# EAGLE schematic Untitled (EAGLE 7.1.0)
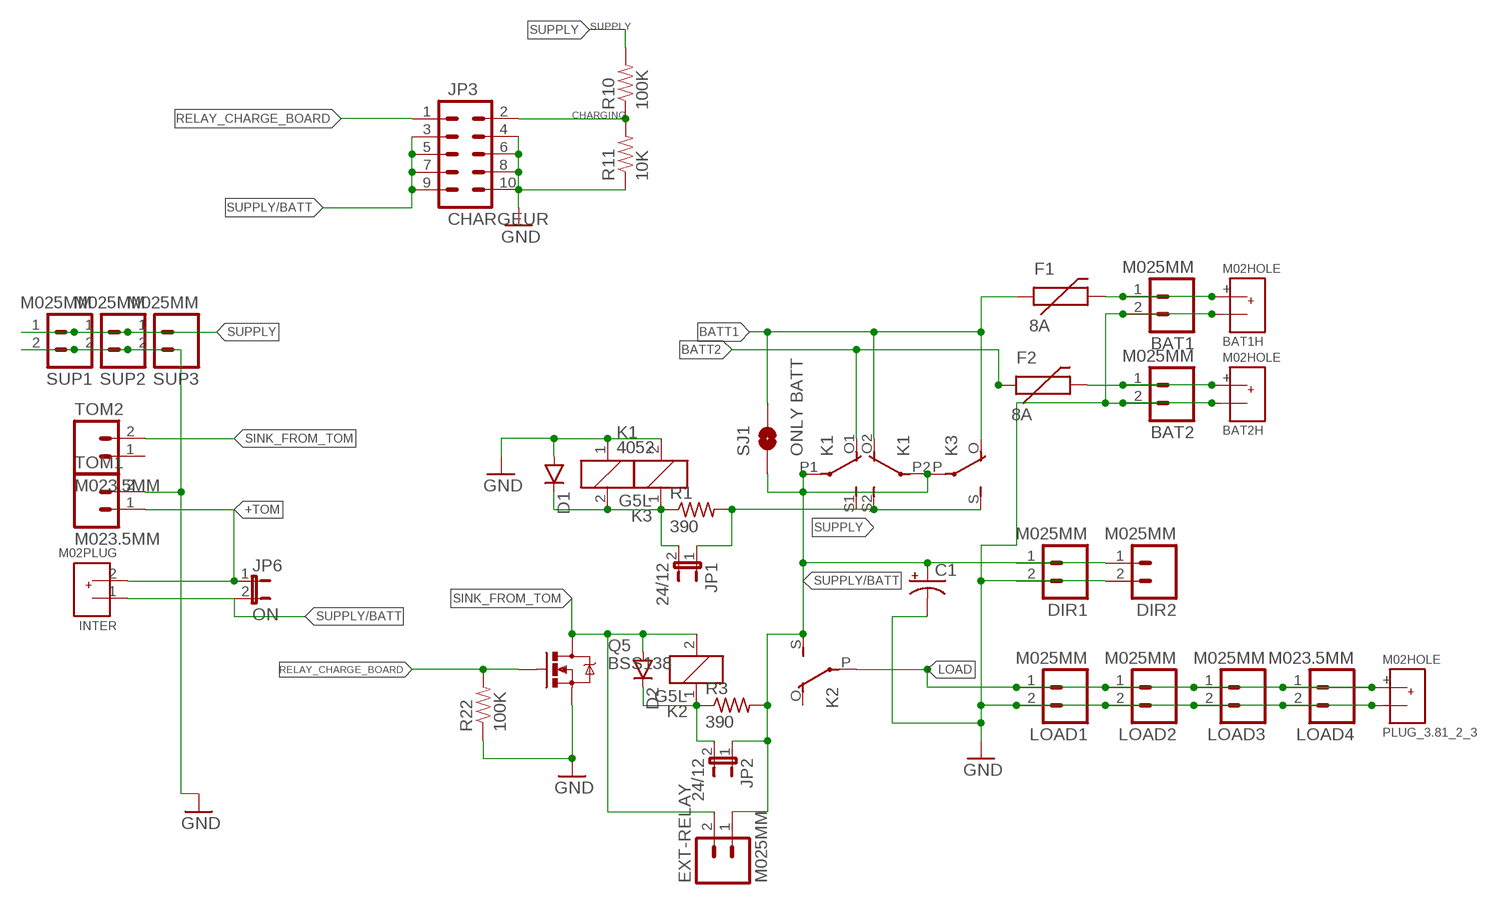
[diagram p0: schematic, sheet 1]

## Parts
BAT1  M025MM  [SCREWTERMINAL-5MM-2]
BAT1H  M02HOLE  [2X1_HOLE_BIG]
BAT2  M025MM  [SCREWTERMINAL-5MM-2]
BAT2H  M02HOLE  [2X1_HOLE_BIG]
C1  CPOL-USSANYO_9F  [SANYO-OSCON_9F]
D1  DIODESMA-ALT  [SMA-DIODE_ALT]
D2  DIODESMA-ALT  [SMA-DIODE_ALT]
DIR1  M025MM  [SCREWTERMINAL-5MM-2]
DIR2  M025MM  [SCREWTERMINAL-5MM-2]
EXT-RELAY  M025MM  [SCREWTERMINAL-5MM-2]
F1  8A  PTCPTH  [PTC]
F2  8A  PTCPTH  [PTC]
INTER  M02PLUG  [PLUG_02]
JP1  24/12  JUMPER-2PTH_LOCK  [1X02_LOCK]
JP2  24/12  JUMPER-2PTH_LOCK  [1X02_LOCK]
JP3  CHARGEUR  M05X2  [2X5_LOCK]
JP6  ON  JUMPER-2PTH_LOCK  [1X02_LOCK]
K1  4052  [F4052]
K2  G5L  [G5LE]
K3  G5L  [G5LE]
LOAD1  M025MM  [SCREWTERMINAL-5MM-2]
LOAD2  M025MM  [SCREWTERMINAL-5MM-2]
LOAD3  M025MM  [SCREWTERMINAL-5MM-2]
LOAD4  M023.5MM  [SCREWTERMINAL-3.5MM-2]
PLUG_3.81_2_3  M02HOLE  [2X1_HOLE_BIG]
Q5  BSS138  MOSFET-NCHANNELBSS138  [SOT23-3]
R1  390  R-US_R2512  [R2512]
R3  390  R-US_R2512  [R2512]
R10  100K  RESISTOR0603-RES  [0603-RES]
R11  10K  RESISTOR0603-RES  [0603-RES]
R22  100K  RESISTOR0603-RES  [0603-RES]
SJ1  ONLY BATT  SOLDERJUMPERNO  [SJ_2S-NO]
SUP1  M025MM  [SCREWTERMINAL-5MM-2]
SUP2  M025MM  [SCREWTERMINAL-5MM-2]
SUP3  M025MM  [SCREWTERMINAL-5MM-2]
TOM1  M023.5MM  [SCREWTERMINAL-3.5MM-2]
TOM2  M023.5MM  [SCREWTERMINAL-3.5MM-2]

## Nets
+TOM: INTER.2 JP6.1 TOM1.1
BATT1: F1.P$1MOV K1.O2(3:O) K3.O(2:O) SJ1.2
BATT2: F2.P$1MOV K1.O1(2:O)
CHARGING: JP3.2 R10.1 R11.2
GND [GND]: BAT1.2 BAT1H._ BAT2.2 BAT2H._ C1.- D1.A DIR1.2 DIR2.2 JP3.4 JP3.6 JP3.8 JP3.10 K1.1 K3.2 LOAD1.2 LOAD2.2 LOAD3.2 LOAD4.2 PLUG_3.81_2_3._ Q5.2(S) R11.1 R22.1 SUP1.2 SUP2.2 SUP3.2 TOM1.2
LOAD: K2.P(2:P) LOAD1.1 LOAD2.1 LOAD3.1 LOAD4.1 PLUG_3.81_2_3.+
N$1: D1.C JP1.2 K1.2 K3.1 R1.1
N$2: BAT1.1 BAT1H.+ F1.P$2
N$3: BAT2.1 BAT2H.+ F2.P$2
N$4: D2.C JP2.2 K2.1 R3.1
RELAY_CHARGE_BOARD: JP3.1 Q5.1(G) R22.2
SINK_FROM_TOM: D2.A EXT-RELAY.2 K2.2 Q5.3(D) TOM2.2
SUPPLY: JP1.1 K1.S1(2:S) K1.S2(3:S) K3.S(2:S) R1.2 R10.2 SUP1.1 SUP2.1 SUP3.1
SUPPLY/BATT: C1.+ DIR1.1 DIR2.1 EXT-RELAY.1 INTER.1 JP2.1 JP3.3 JP3.5 JP3.7 JP3.9 JP6.2 K1.P1(2:P) K1.P2(3:P) K2.S(2:S) K3.P(2:P) R3.2 SJ1.1
Unconnected: K2.O(2:O) TOM2.1

## Library data of the parts
BAT1 BAT2 DIR1 DIR2 EXT-RELAY LOAD1-LOAD3 SUP1-SUP3 = SparkFun-Connectors:M02: Standard 2-pin 0.1" header. Use with - straight break away headers ( PRT-00116) - right angle break away headers (PRT-00553) - swiss pins (PRT-00743) - machine pins (PRT-00117) - female headers (PRT-00115) Molex polarized connector foot print use with: PRT-08233 with associated crimp pins and housings. 2.54_SCREWTERM for use with PRT-10571. 3.5mm Screw Terminal footprints for PRT-08084 5mm Screw Terminal footprints for use with PRT-08432; STOREFRONT_ID: PRT-08432
BAT1H BAT2H INTER PLUG_3.81_2_3 = pierre_vv:M02
C1 = rcl:CPOL-US: POLARIZED CAPACITOR, American symbol
D1 D2 = SparkFun-DiscreteSemi:DIODE: Diode These are standard reverse protection diodes and small signal diodes. SMA package can handle up to about 1A. SOD-323 can handle about 200mA. What the SOD-323 package when ordering, there are some mfgs out there that are 5-pin packages.; OC_FARNELL: 2101190
F1 F2 = SparkFun:PTC: Resettable Fuse PTC Resettable Fuse. Spark Fun Electronics SKU : COM-08357; MOUNT: NO; OC_FARNELL: 1861144
JP1 JP2 JP6 = SparkFun:JUMPER-2: Jumper Basic 0.1" spaced jumper. Use with breakaway headers.
JP3 = pierre_vv:M05X2; C: 1
K1 = relay:4052: RELAY 2 x switch, Finder; OC_FARNELL: 1169304; OC_NEWARK: unknown
K2 = relay:G5L: RELAY 1 x switch, 10 A/120 V AC, 8 A/30 V ADC, Omron; OC_FARNELL: unknown; OC_NEWARK: unknown
K3 = relay:G5L: RELAY 1 x switch, 10 A/120 V AC, 8 A/30 V ADC, Omron; OC_FARNELL: 1455504; OC_NEWARK: unknown
LOAD4 TOM1 TOM2 = SparkFun-Connectors:M02: Standard 2-pin 0.1" header. Use with - straight break away headers ( PRT-00116) - right angle break away headers (PRT-00553) - swiss pins (PRT-00743) - machine pins (PRT-00117) - female headers (PRT-00115) Molex polarized connector foot print use with: PRT-08233 with associated crimp pins and housings. 2.54_SCREWTERM for use with PRT-10571. 3.5mm Screw Terminal footprints for PRT-08084 5mm Screw Terminal footprints for use with PRT-08432
Q5 = SparkFun-DiscreteSemi:MOSFET-NCHANNEL: Common NMOSFET Parts MFG P/N Store ID Prod ID FDD8780 TRANS-09984 SI7820DN TRANS-11055 FDS6630A IC-08089 2N7002PW TRANS-11151 FQP30N06L COM-10213 TRANS-10060 BSS123LT1G TRANS-08345 BSS138 TRANS-00830 BS170 2N7000; C: 1; PROD_ID: TRANS-00830
R1 R3 = rcl:R-US_: RESISTOR, American symbol
R10 R11 R22 = SparkFun-Passives:RESISTOR: Resistor Basic schematic elements and footprints for 0603, 1206, and PTH resistors.; C: 1
SJ1 = SparkFun:SOLDERJUMPER: Solder Jumper Standard SMD solder jumper. Used to automate production. Two varients : Normally Open and Normally Closed are the same, but have different paste layers. NC will have a large amount of paste and should jumper during reflow.

## Net classes
0 default: width 0.203 mm, clearance 0.203 mm
1 GND: width 0.254 mm, clearance 0.203 mm
3 5V: width 0.305 mm, clearance 0.203 mm
4 230AC: width 0.61 mm, clearance 0.305 mm